# Altium schematic sheet CON_ADCDAC_HDR14M.SchDoc: ADC / DAC Header
size A4; Organization: Altium Limited.; Address1: Level 3, 12a Rodborough Rd; Address2: Frenchs Forest 2086; Address3: NSW; Address4: AUSTRALIA; SheetNumber: 1; SheetTotal: 100
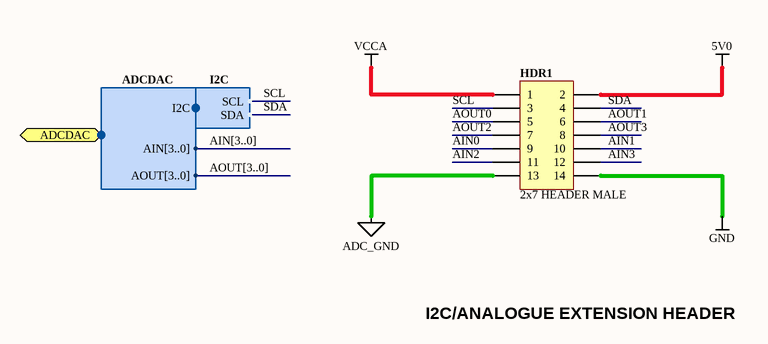
[diagram p0: CON_ADCDAC_HDR14M.SchDoc]

## Parts
HDR1  2x7 HEADER MALE  [HDR2X7]

## Ports
ADCDAC (harness ADCDAC)

## Harnesses
ADCDAC: AIN[3..0], AOUT[3..0], I2C
I2C: SCL, SDA

## Nets
5V0: HDR1.2
ADC_GND: HDR1.13
GND: HDR1.14
VCCA: HDR1.1
AIN0: HDR1.9
AIN1: HDR1.10
AIN2: HDR1.11
AIN3: HDR1.12
AOUT0: HDR1.5
AOUT1: HDR1.6
AOUT2: HDR1.7
AOUT3: HDR1.8
SCL: HDR1.3 ; harness I2C.SCL
SDA: HDR1.4 ; harness I2C.SDA

## Buses and harness runs
bus AIN[3..0]
bus AOUT[3..0]

## Notes on the sheet
- I2C/ANALOGUE EXTENSION HEADER
- Sheet Title
- Project Title
- Size:
- Date:
- A4
- Assy:
- Time:
- Revision:
- Sheet
- of
- File:

## Library data of the parts
HDR1 = D-300-0017: Header IDC, 2 x 7 Pin Vertical 2.54mm Pitch (Non-Boxed, Male); Max Current: 3 A; Category: Connector; Connector type: Header; Mounting Technology: Through-Hole; Pin Count: 14; Status: Production